# EAGLE design DMAC Replacement (EAGLE 9.6.2)

## Sheet 1 of 2
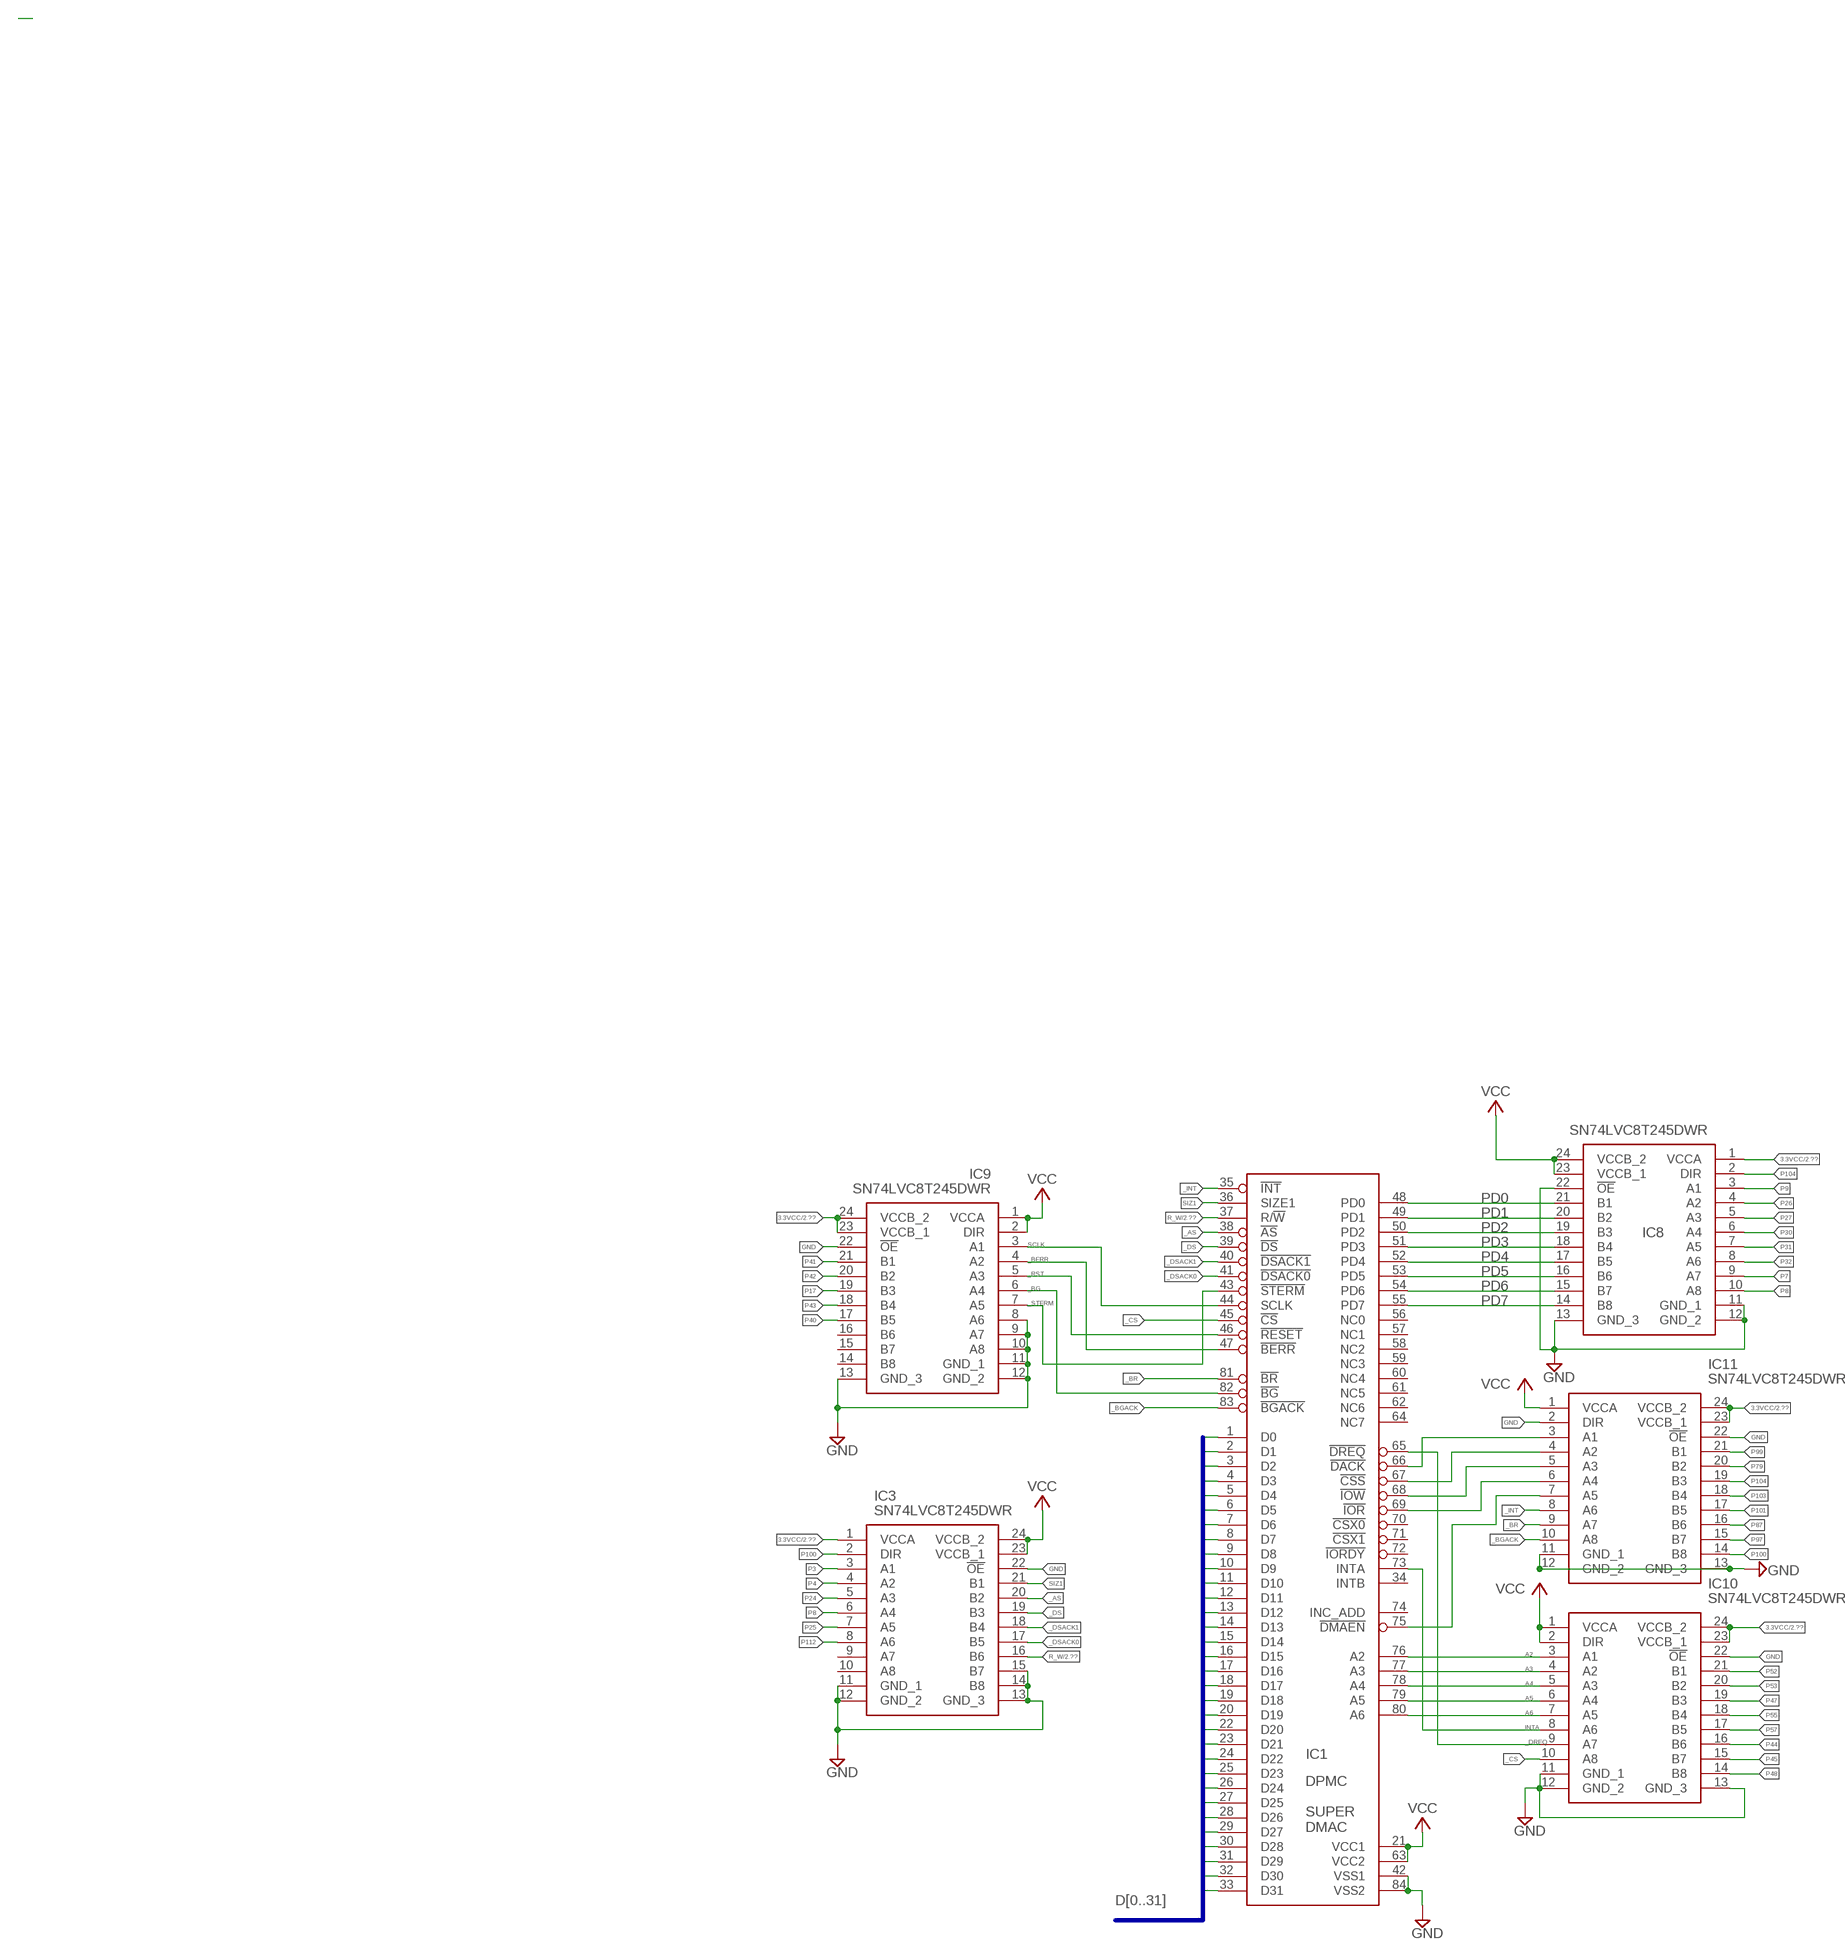
[diagram p0: schematic, sheet 1, part 1 of 2]
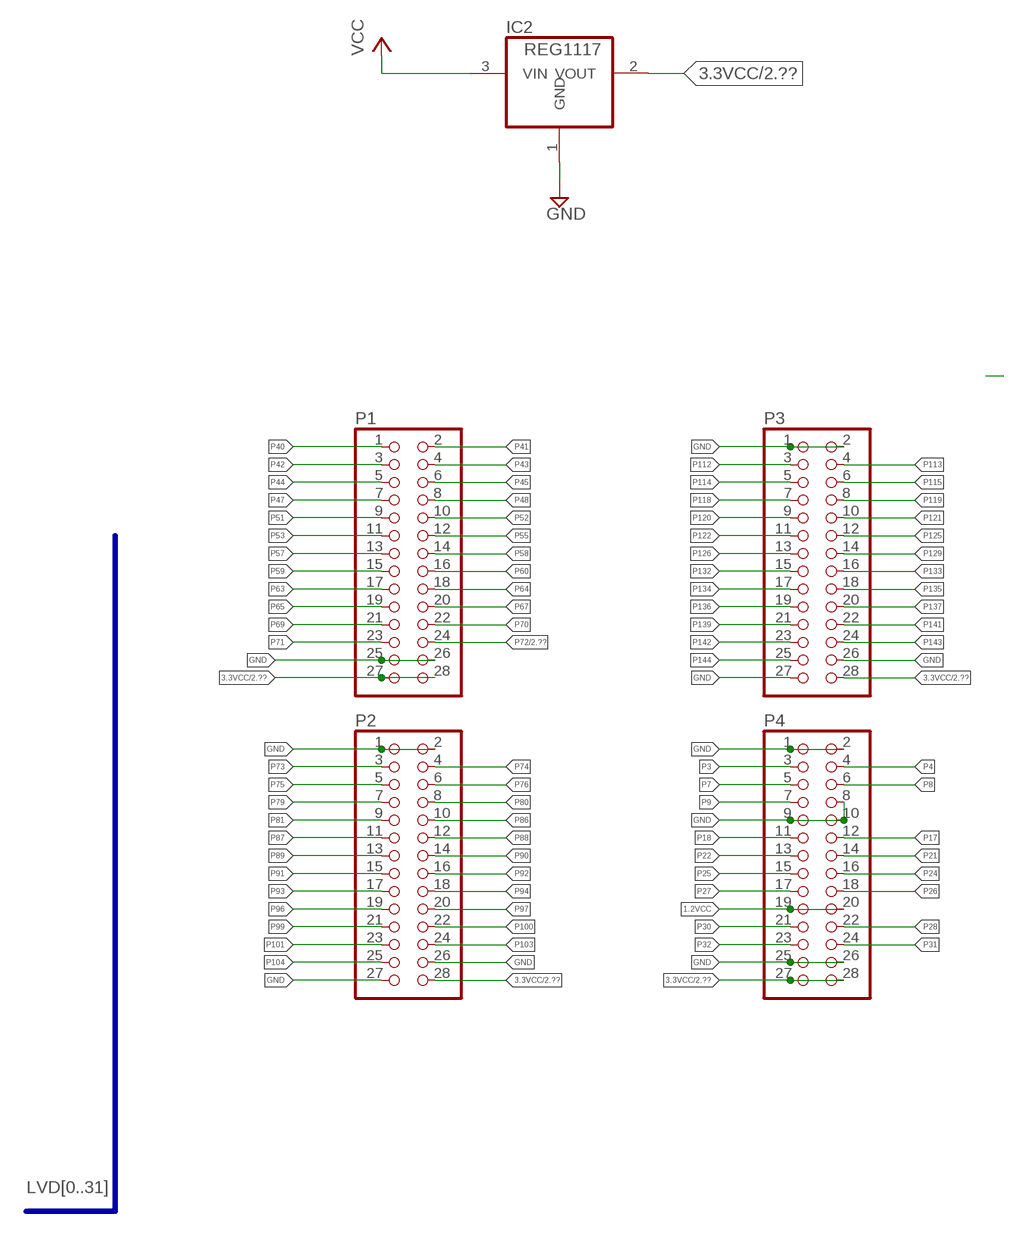
[diagram p1: schematic, sheet 1, part 2 of 2]

### Parts
IC1  SUPER_DMAC_THT  [PLCC84_T]
IC2  REG1117  [SOT223]
IC3  SN74LVC8T245DWR  [SOIC127P1030X265-24N]
IC8  SN74LVC8T245DWR  [SOIC127P1030X265-24N]
IC9  SN74LVC8T245DWR  [SOIC127P1030X265-24N]
IC10  SN74LVC8T245DWR  [SOIC127P1030X265-24N]
IC11  SN74LVC8T245DWR  [SOIC127P1030X265-24N]
P1  PINHD-2X14  [2X14]
P2  PINHD-2X14  [2X14]
P3  PINHD-2X14  [2X14]
P4  PINHD-2X14  [2X14]

### Nets
1.2VCC [Power]: P4.19 P4.20
3.3VCC [Power]: IC2.2(VOUT) IC3.1(VCCA) IC8.1(VCCA) IC9.23(VCCB_1) IC9.24(VCCB_2) IC10.23(VCCB_1) IC10.24(VCCB_2) IC11.23(VCCB_1) IC11.24(VCCB_2) P1.27 P1.28 P2.28 P3.28 P4.27 P4.28 ; also sheet 2
_AS: IC1.38(!AS) IC3.20(B2)
_BERR: IC1.47(!BERR) IC9.4(A2)
_BG: IC1.82(!BG) IC9.6(A4)
_BGACK: IC1.83(!BGACK) IC11.10(A8)
_BR: IC1.81(!BR) IC11.9(A7)
_CS: IC1.45(!CS) IC10.10(A8)
_CSS: IC1.67(!CSS) IC11.4(A2)
_DACK: IC1.66(!DACK) IC11.3(A1)
_DMAEN: IC1.75(!DMAEN) IC11.7(A5)
_DREQ: IC1.65(!DREQ) IC10.9(A7)
_DS: IC1.39(!DS) IC3.19(B3)
_DSACK0: IC1.41(!DSACK0) IC3.17(B5)
_DSACK1: IC1.40(!DSACK1) IC3.18(B4)
_INT: IC1.35(!INT) IC11.8(A6)
_IOR: IC1.69(!IOR) IC11.6(A4)
_IOW: IC1.68(!IOW) IC11.5(A3)
_RST: IC1.46(!RESET) IC9.5(A3)
_STERM: IC1.43(!STERM) IC9.7(A5)
A2: IC1.76(A2) IC10.3(A1)
A3: IC1.77(A3) IC10.4(A2)
A4: IC1.78(A4) IC10.5(A3)
A5: IC1.79(A5) IC10.6(A4)
A6: IC1.80(A6) IC10.7(A5)
D0: IC1.1(D0) ; also sheet 2
D1: IC1.2(D1) ; also sheet 2
D2: IC1.3(D2) ; also sheet 2
D3: IC1.4(D3) ; also sheet 2
D4: IC1.5(D4) ; also sheet 2
D5: IC1.6(D5) ; also sheet 2
D6: IC1.7(D6) ; also sheet 2
D7: IC1.8(D7) ; also sheet 2
D8: IC1.9(D8) ; also sheet 2
D9: IC1.10(D9) ; also sheet 2
D10: IC1.11(D10) ; also sheet 2
D11: IC1.12(D11) ; also sheet 2
D12: IC1.13(D12) ; also sheet 2
D13: IC1.14(D13) ; also sheet 2
D14: IC1.15(D14) ; also sheet 2
D15: IC1.16(D15) ; also sheet 2
D16: IC1.17(D16) ; also sheet 2
D17: IC1.18(D17) ; also sheet 2
D18: IC1.19(D18) ; also sheet 2
D19: IC1.20(D19) ; also sheet 2
D20: IC1.22(D20) ; also sheet 2
D21: IC1.23(D21) ; also sheet 2
D22: IC1.24(D22) ; also sheet 2
D23: IC1.25(D23) ; also sheet 2
D24: IC1.26(D24) ; also sheet 2
D25: IC1.27(D25) ; also sheet 2
D26: IC1.28(D26) ; also sheet 2
D27: IC1.29(D27) ; also sheet 2
D28: IC1.30(D28) ; also sheet 2
D29: IC1.31(D29) ; also sheet 2
D30: IC1.32(D30) ; also sheet 2
D31: IC1.33(D31) ; also sheet 2
GND [GND]: IC1.42(VSS1) IC1.84(VSS2) IC2.1(GND) IC3.11(GND_1) IC3.12(GND_2) IC3.13(GND_3) IC3.14(B8) IC3.15(B7) IC3.22(!OE) IC8.11(GND_1) IC8.12(GND_2) IC8.13(GND_3) IC8.22(!OE) IC9.8(A6) IC9.9(A7) IC9.10(A8) IC9.11(GND_1) IC9.12(GND_2) IC9.13(GND_3) IC9.22(!OE) IC10.11(GND_1) IC10.12(GND_2) IC10.13(GND_3) IC10.22(!OE) IC11.2(DIR) IC11.11(GND_1) IC11.12(GND_2) IC11.13(GND_3) IC11.22(!OE) P1.25 P1.26 P2.1 P2.2 P2.26 P2.27 P3.1 P3.2 P3.26 P3.27 P4.1 P4.2 P4.8 P4.9 P4.10 P4.25 P4.26 ; also sheet 2
INTA: IC1.73(INTA) IC10.8(A6)
P3: IC3.3(A1) P4.3
P4: IC3.4(A2) P4.4
P7: IC8.9(A7) P4.5
P8: IC3.6(A4) IC8.10(A8) P4.6
P9: IC8.3(A1) P4.7
P17: IC9.19(B3) P4.12
P18: P4.11
P21: P4.14
P22: P4.13
P24: IC3.5(A3) P4.16
P25: IC3.7(A5) P4.15
P26: IC8.4(A2) P4.18
P27: IC8.5(A3) P4.17
P28: P4.22
P30: IC8.6(A4) P4.21
P31: IC8.7(A5) P4.24
P32: IC8.8(A6) P4.23
P40: IC9.17(B5) P1.1
P41: IC9.21(B1) P1.2
P42: IC9.20(B2) P1.3
P43: IC9.18(B4) P1.4
P44: IC10.16(B6) P1.5
P45: IC10.15(B7) P1.6
P47: IC10.19(B3) P1.7
P48: IC10.14(B8) P1.8
P51: P1.9
P52: IC10.21(B1) P1.10
P53: IC10.20(B2) P1.11
P55: IC10.18(B4) P1.12
P57: IC10.17(B5) P1.13
P58: P1.14
P59: P1.15
P60: P1.16
P63: P1.17
P64: P1.18
P65: P1.19
P67: P1.20
P69: P1.21
P70: P1.22
P71: P1.23
P72: P1.24 ; also sheet 2
P73: P2.3
P74: P2.4
P75: P2.5
P76: P2.6
P79: IC11.20(B2) P2.7
P80: P2.8
P81: P2.9
P86: P2.10
P87: IC11.16(B6) P2.11
P88: P2.12
P89: P2.13
P90: P2.14
P91: P2.15
P92: P2.16
P93: P2.17
P94: P2.18
P96: P2.19
P97: IC11.15(B7) P2.20
P99: IC11.21(B1) P2.21
P100: IC3.2(DIR) IC11.14(B8) P2.22
P101: IC11.17(B5) P2.23
P103: IC11.18(B4) P2.24
P104: IC8.2(DIR) IC11.19(B3) P2.25
P112: IC3.8(A6) P3.3
P113: P3.4
P114: P3.5
P115: P3.6
P118: P3.7
P119: P3.8
P120: P3.9
P121: P3.10
P122: P3.11
P125: P3.12
P126: P3.13
P129: P3.14
P132: P3.15
P133: P3.16
P134: P3.17
P135: P3.18
P136: P3.19
P137: P3.20
P139: P3.21
P141: P3.22
P142: P3.23
P143: P3.24
P144: P3.25
PD0: IC1.48(PD0) IC8.21(B1)
PD1: IC1.49(PD1) IC8.20(B2)
PD2: IC1.50(PD2) IC8.19(B3)
PD3: IC1.51(PD3) IC8.18(B4)
PD4: IC1.52(PD4) IC8.17(B5)
PD5: IC1.53(PD5) IC8.16(B6)
PD6: IC1.54(PD6) IC8.15(B7)
PD7: IC1.55(PD7) IC8.14(B8)
R_W: IC1.37(R/!W!) IC3.16(B6) ; also sheet 2
SCLK: IC1.44(SCLK) IC9.3(A1)
SIZ1: IC1.36(SIZE1) IC3.21(B1)
VCC [Power]: IC1.21(VCC1) IC1.63(VCC2) IC2.3(VIN) IC3.23(VCCB_1) IC3.24(VCCB_2) IC8.23(VCCB_1) IC8.24(VCCB_2) IC9.1(VCCA) IC9.2(DIR) IC10.1(VCCA) IC10.2(DIR) IC11.1(VCCA) ; also sheet 2
Unconnected: IC1.34(INTB) IC1.56(NC0) IC1.57(NC1) IC1.58(NC2) IC1.59(NC3) IC1.60(NC4) IC1.61(NC5) IC1.62(NC6) IC1.64(NC7) IC1.70(!CSX0) IC1.71(!CSX1) IC1.72(!IORDY) IC1.74(INC_ADD) IC3.9(A7) IC3.10(A8) IC9.14(B8) IC9.15(B7) IC9.16(B6)

### Buses
D[0..31]
LVD[0..31]

## Sheet 2 of 2: Databus buffers
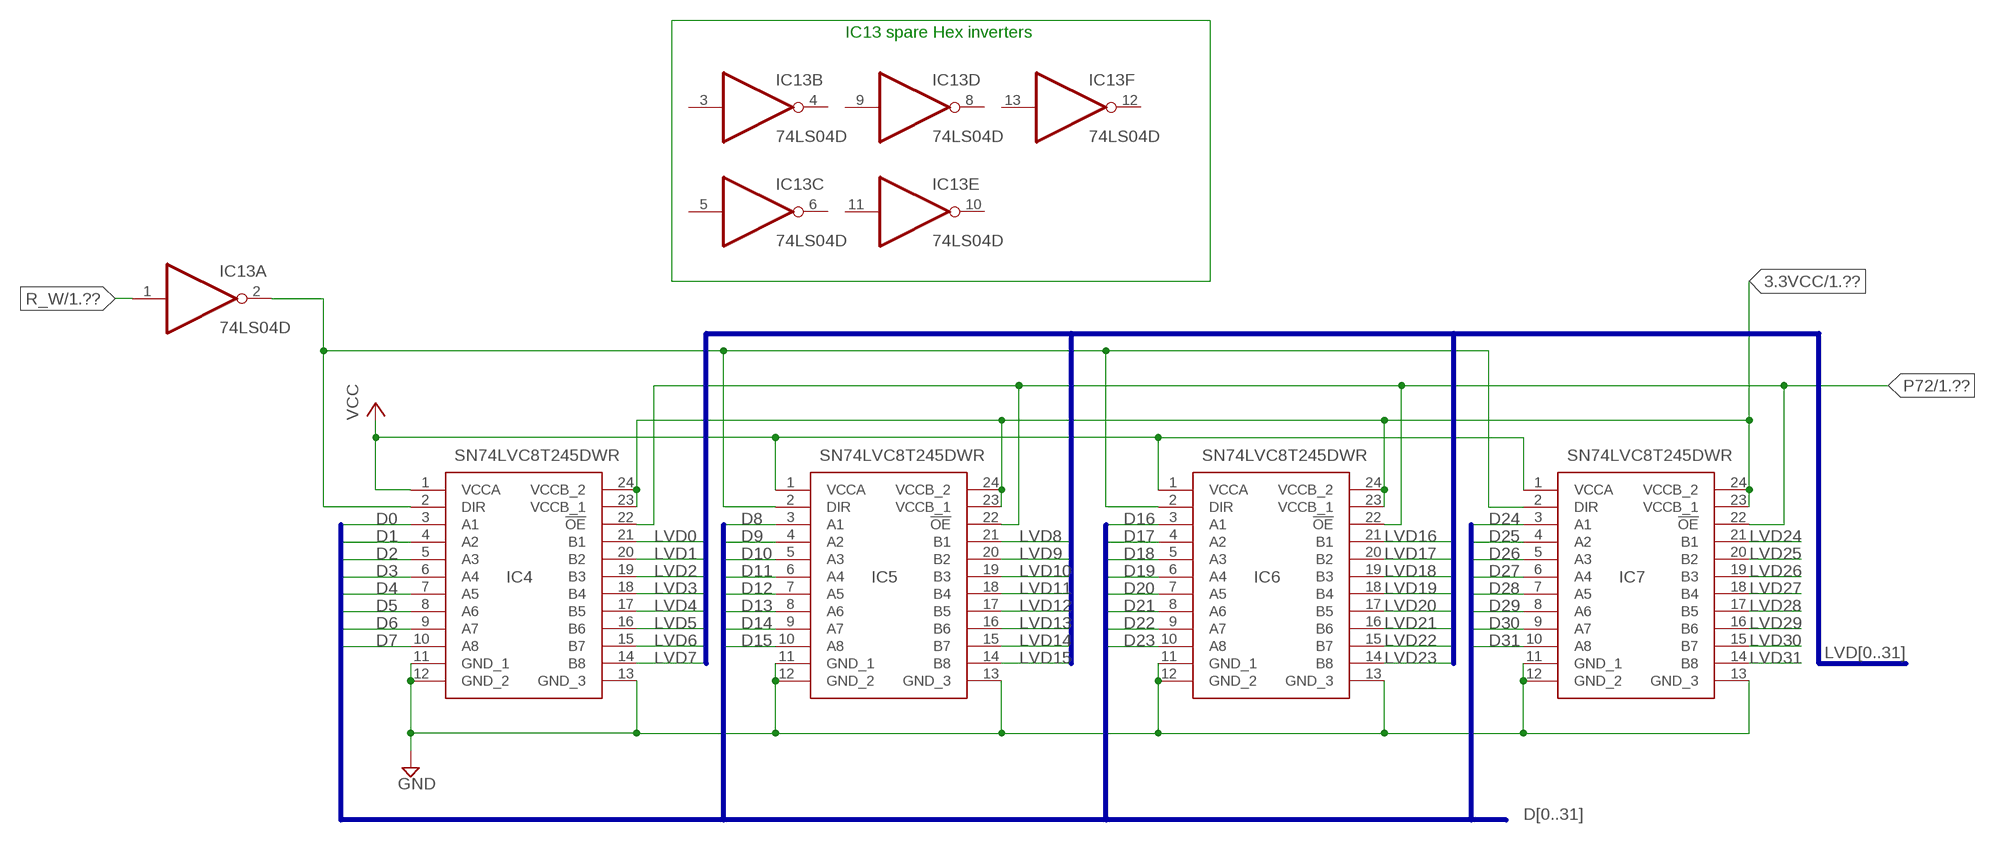
[diagram p2: schematic, sheet 2]

### Parts
IC4  SN74LVC8T245DWR  [SOIC127P1030X265-24N]
IC5  SN74LVC8T245DWR  [SOIC127P1030X265-24N]
IC6  SN74LVC8T245DWR  [SOIC127P1030X265-24N]
IC7  SN74LVC8T245DWR  [SOIC127P1030X265-24N]
IC13  74LS04D  [SO14]

### Nets
3.3VCC [Power]: IC4.23(VCCB_1) IC4.24(VCCB_2) IC5.23(VCCB_1) IC5.24(VCCB_2) IC6.23(VCCB_1) IC6.24(VCCB_2) IC7.23(VCCB_1) IC7.24(VCCB_2) ; also sheet 1
_RW: IC4.2(DIR) IC5.2(DIR) IC6.2(DIR) IC7.2(DIR) IC13.2(A:O)
D0: IC4.3(A1) ; also sheet 1
D1: IC4.4(A2) ; also sheet 1
D2: IC4.5(A3) ; also sheet 1
D3: IC4.6(A4) ; also sheet 1
D4: IC4.7(A5) ; also sheet 1
D5: IC4.8(A6) ; also sheet 1
D6: IC4.9(A7) ; also sheet 1
D7: IC4.10(A8) ; also sheet 1
D8: IC5.3(A1) ; also sheet 1
D9: IC5.4(A2) ; also sheet 1
D10: IC5.5(A3) ; also sheet 1
D11: IC5.6(A4) ; also sheet 1
D12: IC5.7(A5) ; also sheet 1
D13: IC5.8(A6) ; also sheet 1
D14: IC5.9(A7) ; also sheet 1
D15: IC5.10(A8) ; also sheet 1
D16: IC6.3(A1) ; also sheet 1
D17: IC6.4(A2) ; also sheet 1
D18: IC6.5(A3) ; also sheet 1
D19: IC6.6(A4) ; also sheet 1
D20: IC6.7(A5) ; also sheet 1
D21: IC6.8(A6) ; also sheet 1
D22: IC6.9(A7) ; also sheet 1
D23: IC6.10(A8) ; also sheet 1
D24: IC7.3(A1) ; also sheet 1
D25: IC7.4(A2) ; also sheet 1
D26: IC7.5(A3) ; also sheet 1
D27: IC7.6(A4) ; also sheet 1
D28: IC7.7(A5) ; also sheet 1
D29: IC7.8(A6) ; also sheet 1
D30: IC7.9(A7) ; also sheet 1
D31: IC7.10(A8) ; also sheet 1
GND [GND]: IC4.11(GND_1) IC4.12(GND_2) IC4.13(GND_3) IC5.11(GND_1) IC5.12(GND_2) IC5.13(GND_3) IC6.11(GND_1) IC6.12(GND_2) IC6.13(GND_3) IC7.11(GND_1) IC7.12(GND_2) IC7.13(GND_3) ; also sheet 1
LVD0: IC4.21(B1)
LVD1: IC4.20(B2)
LVD2: IC4.19(B3)
LVD3: IC4.18(B4)
LVD4: IC4.17(B5)
LVD5: IC4.16(B6)
LVD6: IC4.15(B7)
LVD7: IC4.14(B8)
LVD8: IC5.21(B1)
LVD9: IC5.20(B2)
LVD10: IC5.19(B3)
LVD11: IC5.18(B4)
LVD12: IC5.17(B5)
LVD13: IC5.16(B6)
LVD14: IC5.15(B7)
LVD15: IC5.14(B8)
LVD16: IC6.21(B1)
LVD17: IC6.20(B2)
LVD18: IC6.19(B3)
LVD19: IC6.18(B4)
LVD20: IC6.17(B5)
LVD21: IC6.16(B6)
LVD22: IC6.15(B7)
LVD23: IC6.14(B8)
LVD24: IC7.21(B1)
LVD25: IC7.20(B2)
LVD26: IC7.19(B3)
LVD27: IC7.18(B4)
LVD28: IC7.17(B5)
LVD29: IC7.16(B6)
LVD30: IC7.15(B7)
LVD31: IC7.14(B8)
P72: IC4.22(!OE) IC5.22(!OE) IC6.22(!OE) IC7.22(!OE) ; also sheet 1
R_W: IC13.1(A:I) ; also sheet 1
VCC [Power]: IC4.1(VCCA) IC5.1(VCCA) IC6.1(VCCA) IC7.1(VCCA) ; also sheet 1
Unconnected: IC13.3(B:I) IC13.4(B:O) IC13.5(C:I) IC13.6(C:O) IC13.8(D:O) IC13.9(D:I) IC13.10(E:O) IC13.11(E:I) IC13.12(F:O) IC13.13(F:I)

### Buses
D[0..31]
LVD[0..31]

### Notes on the sheet
- IC13 spare Hex inverters

## Power pins joined to a net without a drawn wire
GND: IC13.7(P:GND)
VCC: IC13.14(P:VCC)

## Library data of the parts
IC1 = Amiga:SUPER_DMAC
IC2 = burr-brown:REG1117: 800mA and 1A Low Dropout (LDO) Positive Regulator 1.8V, 2.5V, 2.85V, 3.3V, 5V, and Adj; MPN: REG1117; OC_FARNELL: 1097566; OC_NEWARK: 14P6981
IC3-IC11 = SamacSys_Parts:SN74LVC8T245DWR: 8-Bit Dual-Supply Bus Transceiver with Configurable Voltage-Level Shifting and Three-State Outputs Source: Datasheet <http://www.ti.com/lit/gpn/sn74lvc8t245>; DESCRIPTION: 8-Bit Dual-Supply Bus Transceiver with Configurable Voltage-Level Shifting and Three-State Outputs; HEIGHT: 2.65mm; MANUFACTURER_NAME: Texas Instruments; MANUFACTURER_PART_NUMBER: SN74LVC8T245DWR; MOUSER_PART_NUMBER: 595-SN74LVC8T245DWR; MOUSER_PRICE-STOCK: https://www.mouser.co.uk/ProductDetail/Texas-Instruments/SN74LVC8T245DWR/?qs=dT9u2OTAaVX2fwsENIjeqA%3D%3D
IC13 = 74xx-eu:74*04: Hex INVERTER
P1-P4 = pinhead:PINHD-2X14: PIN HEADER

## Net classes
0 default: width 0.152 mm
1 GND: width 0.305 mm
2 Power: width 0.305 mm

## Board
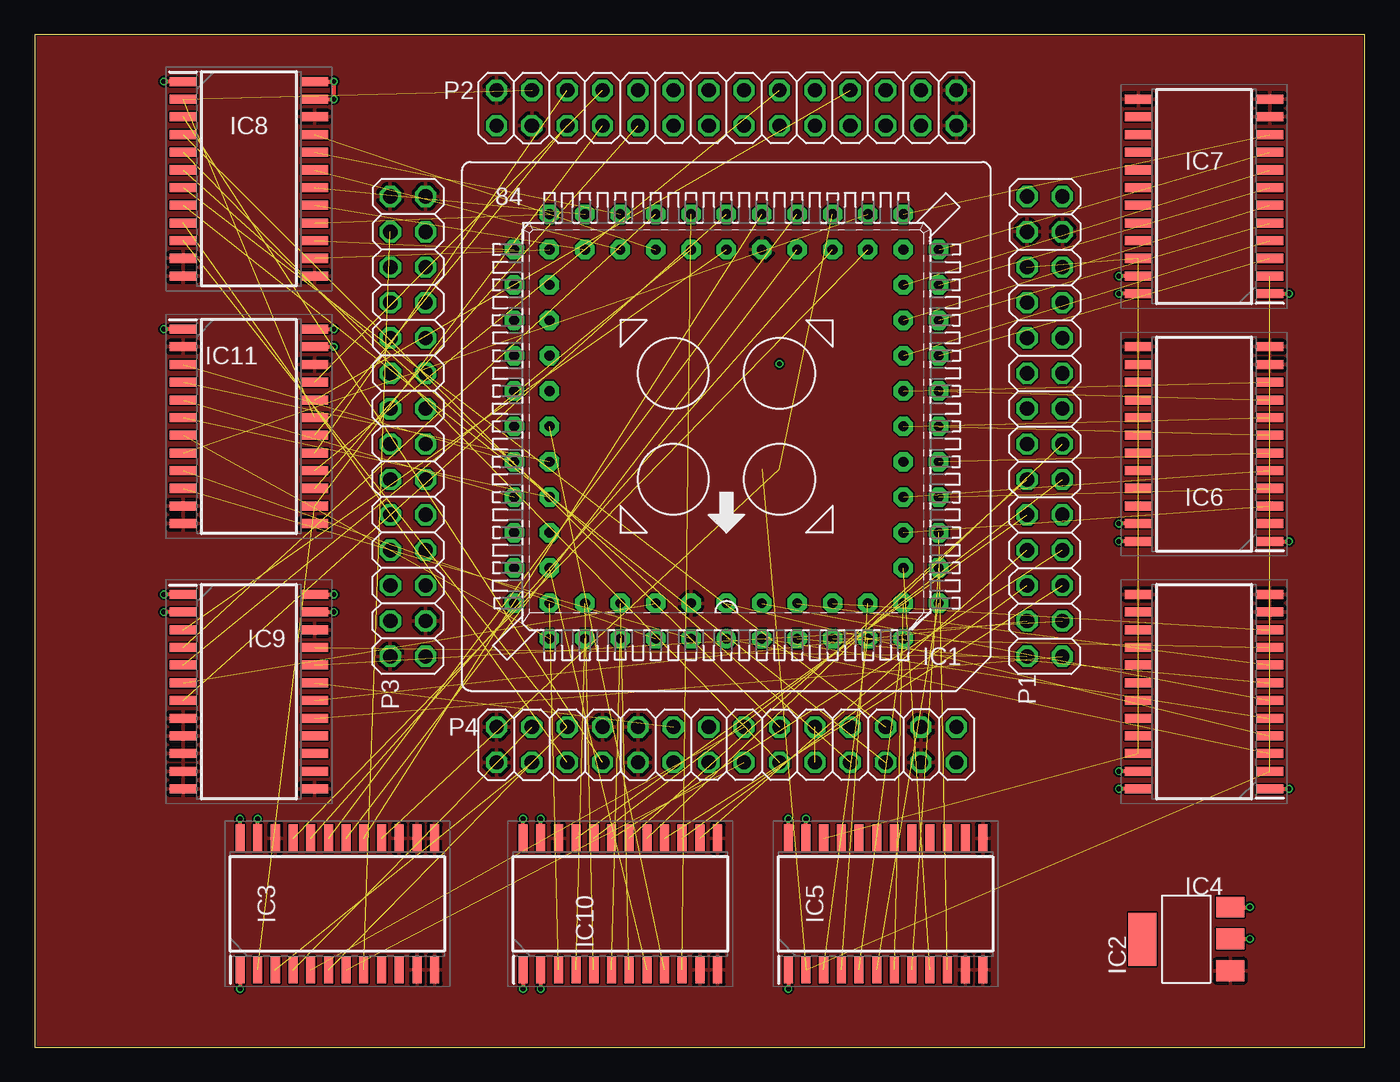
[diagram p3: board, top side]
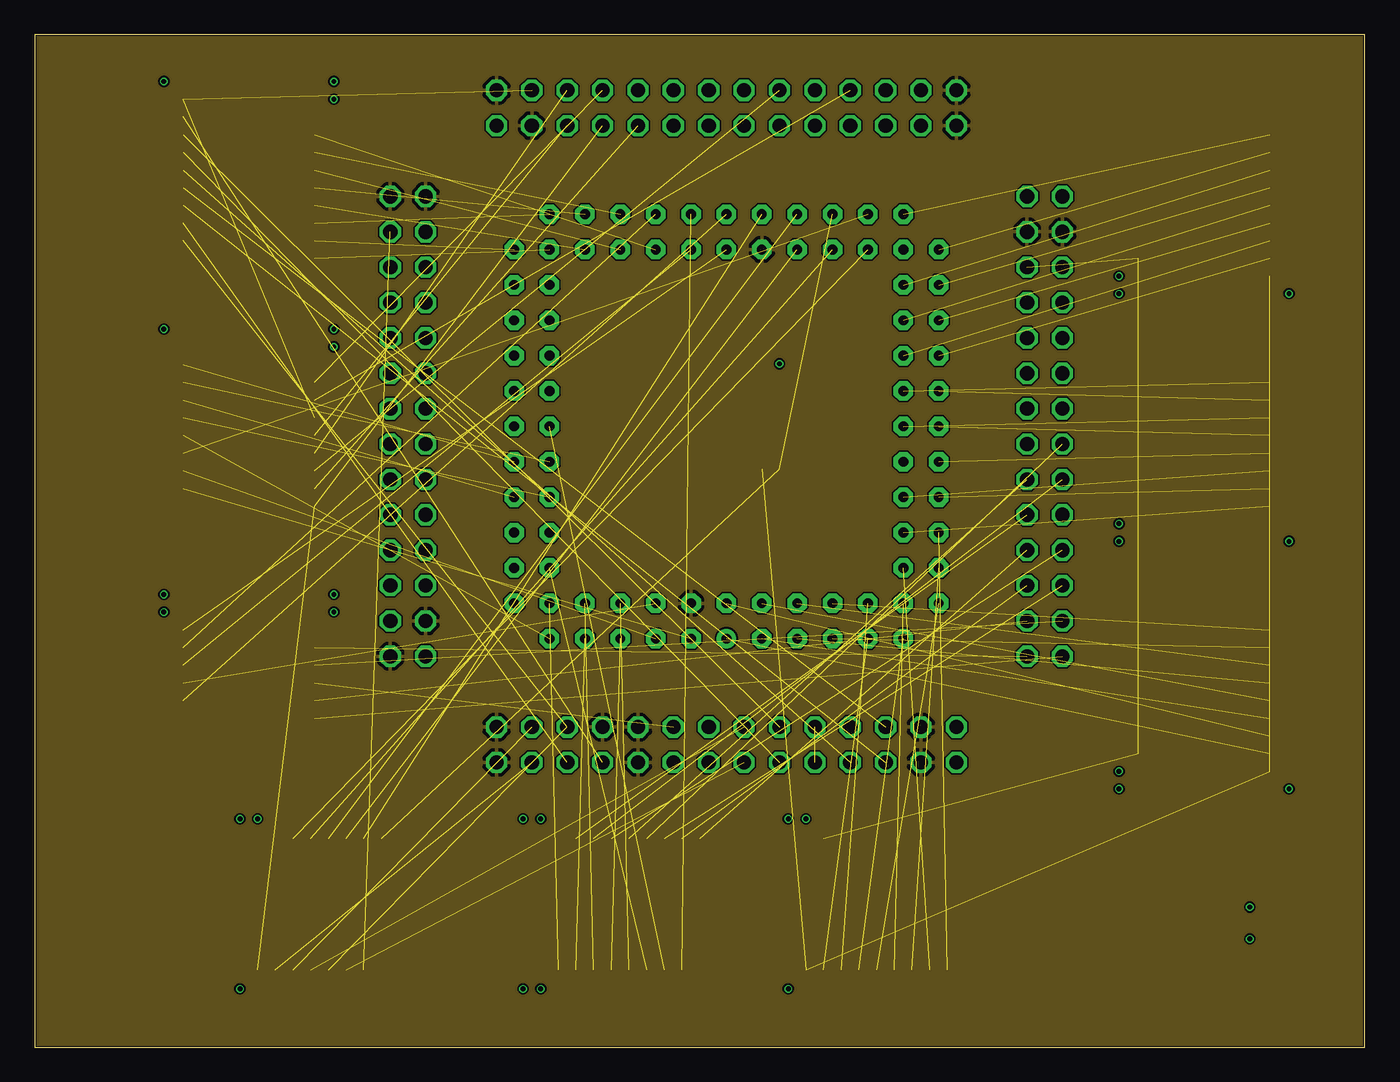
[diagram p4: board, inner layer GND]
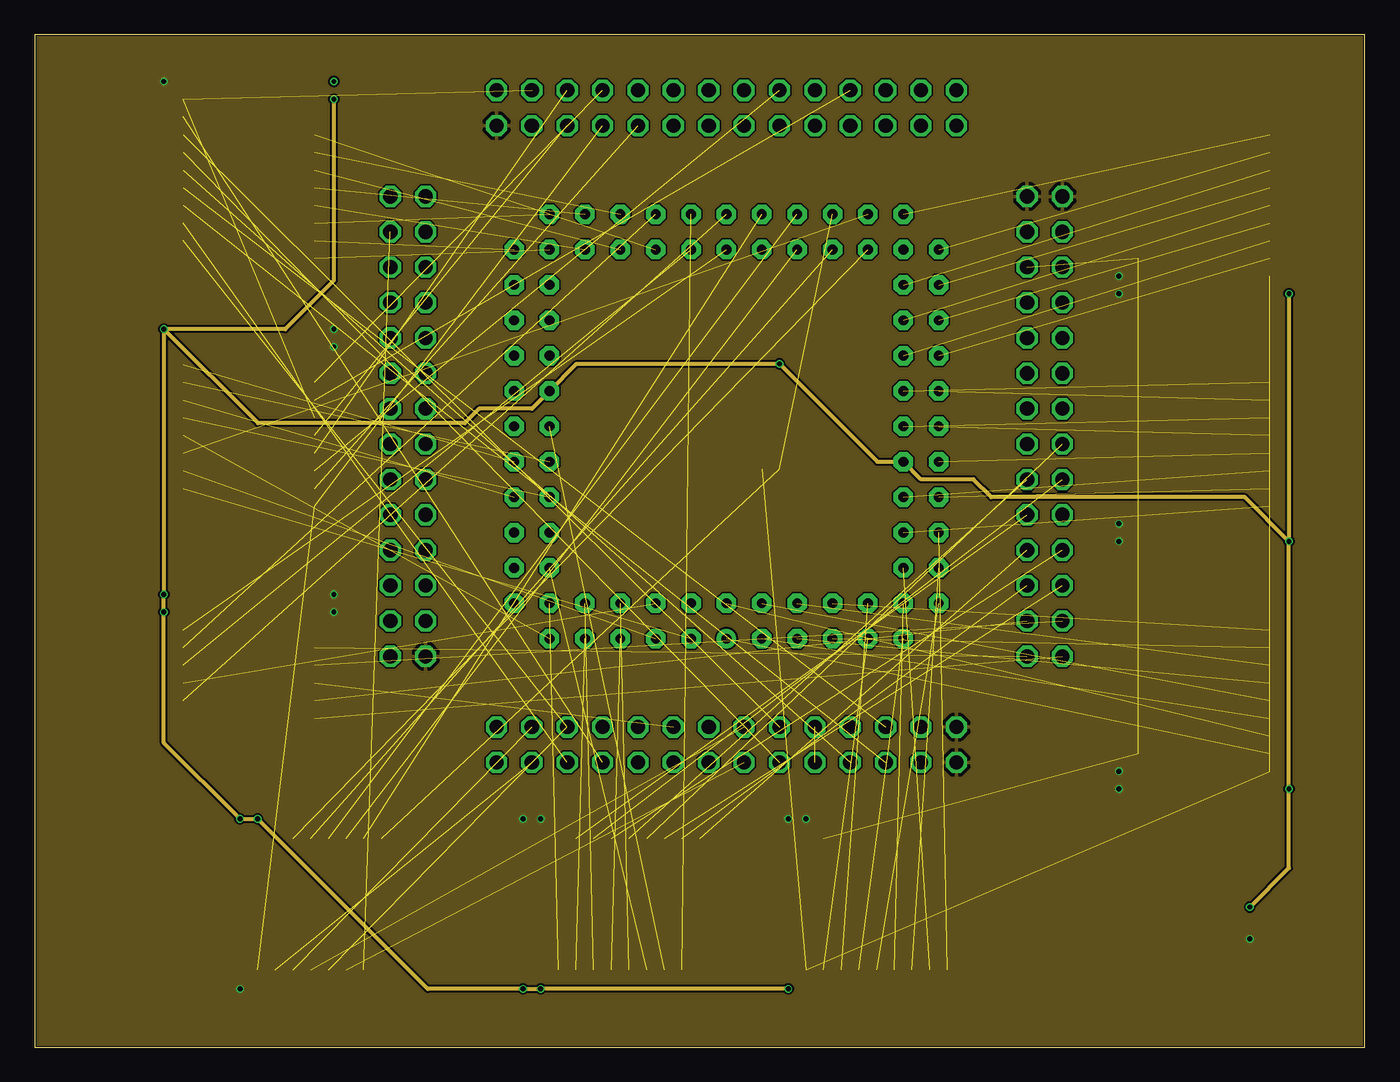
[diagram p5: board, inner layer Power]
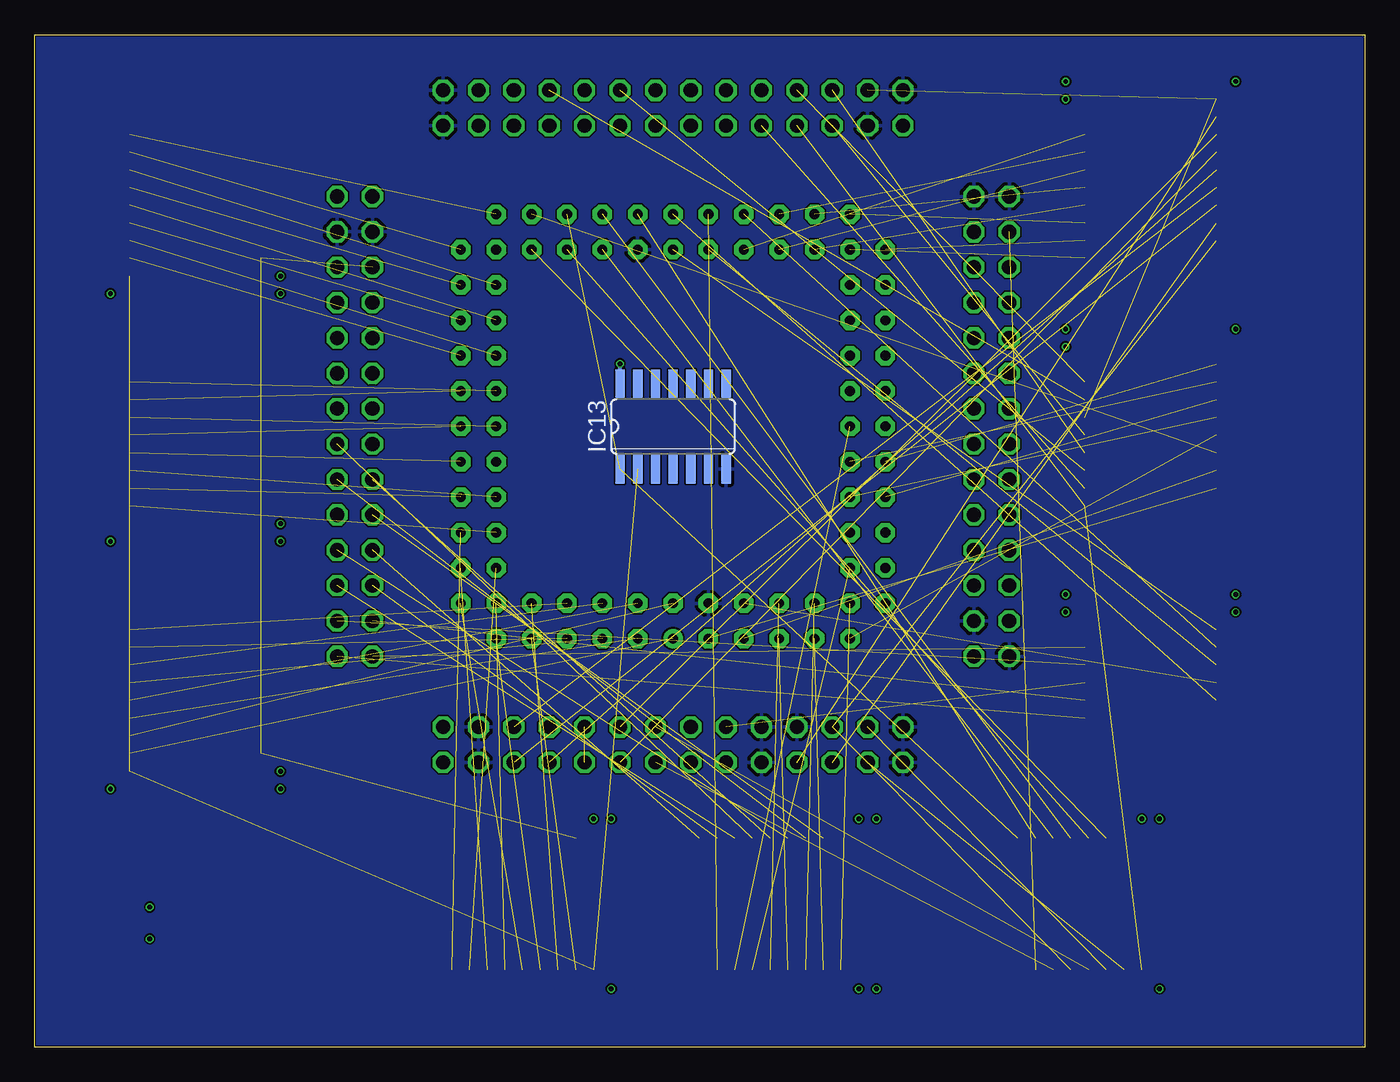
[diagram p6: board, bottom side, seen from below]

Size 95.48 x 72.7 mm. Coordinates in mm from the lower left corner, seen from the top.
Outline: 0,0 95.48,0 95.48,72.7 0,72.7 0,0
Copper layers (1*2*15*16): Top 0.035559375mm / dielectric 0.17018125mm / GND 0.01778125mm / dielectric 47mil / Power 0.01778125mm / dielectric 0.17018125mm / Bottom 0.035559375mm
Design rules "jlcpcb-4-layer": minimum track width 5mil, minimum drill 0.2mm, track to track 0.126490625mm, track to pad 0.126490625mm, pad to pad 0.126490625mm, via to via 0.126490625mm, smd to smd 0mil, copper to edge 0.1mm, drill to drill 5mil, minimum pad ring 4mil, minimum via ring 4mil, stop-mask expansion 3mil, vias tented up to drill 100mil, thermal gap 10mil

### Footprints (pad centres in the part's own frame; a part is rotated, then mirrored left to right if it is on the bottom)
PLCC84_T = drill 0.7 pad 1.4: 1 0,15.24 | drill 0.7 pad 1.4 octagon: 2 0,12.7; 3 -2.54,15.24; 4 -2.54,12.7; 5 -5.08,15.24; 6 -5.08,12.7; 7 -7.62,15.24; 8 -7.62,12.7; 9 -10.16,15.24; 10 -10.16,12.7; 11 -12.7,15.24; 12 -15.24,12.7; 13 -12.7,12.7; 14 -15.24,10.16; 15 -12.7,10.16; 16 -15.24,7.62; 17 -12.7,7.62; 18 -15.24,5.08; 19 -12.7,5.08; 20 -15.24,2.54; 21 -12.7,2.54; 22 -15.24,0; 23 -12.7,0; 24 -15.24,-2.54; 25 -12.7,-2.54; 26 -15.24,-5.08; 27 -12.7,-5.08; 28 -15.24,-7.62; 29 -12.7,-7.62; 30 -15.24,-10.16; 31 -12.7,-10.16; 32 -15.24,-12.7; 33 -12.7,-15.24; 34 -12.7,-12.7; 35 -10.16,-15.24; 36 -10.16,-12.7; 37 -7.62,-15.24; 38 -7.62,-12.7; 39 -5.08,-15.24; 40 -5.08,-12.7; 41 -2.54,-15.24; 42 -2.54,-12.7; 43 0,-15.24; 44 0,-12.7; 45 2.54,-15.24; 46 2.54,-12.7; 47 5.08,-15.24; 48 5.08,-12.7; 49 7.62,-15.24; 50 7.62,-12.7; 51 10.16,-15.24; 52 10.16,-12.7; 53 12.7,-15.24; 54 15.24,-12.7; 55 12.7,-12.7; 56 15.24,-10.16; 57 12.7,-10.16; 58 15.24,-7.62; 59 12.7,-7.62; 60 15.24,-5.08; 61 12.7,-5.08; 62 15.24,-2.54; 63 12.7,-2.54; 64 15.24,0; 65 12.7,0; 66 15.24,2.54; 67 12.7,2.54; 68 15.24,5.08; 69 12.7,5.08; 70 15.24,7.62; 71 12.7,7.62; 72 15.24,10.16; 73 12.7,10.16; 74 15.24,12.7; 75 12.7,15.24; 76 12.7,12.7; 77 10.16,15.24; 78 10.16,12.7; 79 7.62,15.24; 80 7.62,12.7; 81 5.08,15.24; 82 5.08,12.7; 83 2.54,15.24; 84 2.54,12.7
SOT223 = smd 1.499 x 2.007: 1 -2.261,-3.15; 2 0.025,-3.15; 3 2.311,-3.15 | smd 3.81 x 2.007: 4 0,3.15
SOIC127P1030X265-24N = smd 1.95 x 0.65: 1 -4.725,6.985; 2 -4.725,5.715; 3 -4.725,4.445; 4 -4.725,3.175; 5 -4.725,1.905; 6 -4.725,0.635; 7 -4.725,-0.635; 8 -4.725,-1.905; 9 -4.725,-3.175; 10 -4.725,-4.445; 11 -4.725,-5.715; 12 -4.725,-6.985; 13 4.725,-6.985; 14 4.725,-5.715; 15 4.725,-4.445; 16 4.725,-3.175; 17 4.725,-1.905; 18 4.725,-0.635; 19 4.725,0.635; 20 4.725,1.905; 21 4.725,3.175; 22 4.725,4.445; 23 4.725,5.715; 24 4.725,6.985
SO14 = smd 0.66 x 2.032: 1 -3.81,-3.073; 2 -2.54,-3.073; 3 -1.27,-3.073; 4 0,-3.073; 5 1.27,-3.073; 6 2.54,-3.073; 7 3.81,-3.073; 8 3.81,3.073; 9 2.54,3.073; 10 1.27,3.073; 11 0,3.073; 12 -1.27,3.073; 13 -2.54,3.073; 14 -3.81,3.073
2X14 = drill 1.016 octagon: 1 -16.51,-1.27; 2 -16.51,1.27; 3 -13.97,-1.27; 4 -13.97,1.27; 5 -11.43,-1.27; 6 -11.43,1.27; 7 -8.89,-1.27; 8 -8.89,1.27; 9 -6.35,-1.27; 10 -6.35,1.27; 11 -3.81,-1.27; 12 -3.81,1.27; 13 -1.27,-1.27; 14 -1.27,1.27; 15 1.27,-1.27; 16 1.27,1.27; 17 3.81,-1.27; 18 3.81,1.27; 19 6.35,-1.27; 20 6.35,1.27; 21 8.89,-1.27; 22 8.89,1.27; 23 11.43,-1.27; 24 11.43,1.27; 25 13.97,-1.27; 26 13.97,1.27; 27 16.51,-1.27; 28 16.51,1.27

### Placement (x,y rotation side)
IC1  49.66,44.58 180 top
IC2  82.68,7.75 90 top
IC3  21.72,10.29 90 top
IC4  83.95,25.53 180 top
IC5  61.09,10.29 90 top
IC6  83.95,43.31 180 top
IC7  83.95,61.09 180 top
IC8  15.37,62.36 0 top
IC9  15.37,25.53 0 top
IC10  42.04,10.29 90 top
IC11  15.37,44.58 0 top
IC13  49.66,44.58 0 bottom
P1  72.52,44.58 90 top
P2  49.66,67.44 180 top
P3  26.8,44.58 270 top
P4  49.66,21.72 0 top

### Tracks (layer width: path | path; a pad name or v marks a point on that pad's centre or on a via)
1.2VCC  (1 unrouted)
3.3VCC  (via drill 0.35)
  Top 0.305: IC2.2 v87.23,7.77 | IC7.24 v77.84,54.1 | IC7.23 v77.84,55.37 | IC5.24 v54.1,16.39 | IC5.23 v55.37,16.39 | IC4.24 v77.84,18.54 | IC4.23 v77.84,19.81 | IC6.24 v77.84,36.32 | IC6.23 v77.84,37.59 | IC10.24 v35.05,16.39 | IC10.23 v36.32,16.39 | IC11.24 v21.47,51.56 | IC11.23 v21.47,50.29 | IC8.1 v9.26,69.34 | IC9.24 v21.47,32.51 | IC9.23 v21.47,31.24 | IC3.1 v14.73,4.18
  pour Power: 0.13,72.52 0.13,0.13 95.38,0.13 95.38,72.52
_AS  (1 unrouted)
_BERR  (1 unrouted)
_BG  (1 unrouted)
_BGACK  (1 unrouted)
_BR  (1 unrouted)
_CS  (1 unrouted)
_CSS  (1 unrouted)
_DACK  (1 unrouted)
_DMAEN  (1 unrouted)
_DREQ  (1 unrouted)
_DS  (1 unrouted)
_DSACK0  (1 unrouted)
_DSACK1  (1 unrouted)
_INT  (1 unrouted)
_IOR  (1 unrouted)
_IOW  (1 unrouted)
_RST  (1 unrouted)
_RW  (4 unrouted)
_STERM  (1 unrouted)
A2  (1 unrouted)
A3  (1 unrouted)
A4  (1 unrouted)
A5  (1 unrouted)
A6  (1 unrouted)
D0  (1 unrouted)
D1  (1 unrouted)
D2  (1 unrouted)
D3  (1 unrouted)
D4  (1 unrouted)
D5  (1 unrouted)
D6  (1 unrouted)
D7  (1 unrouted)
D8  (1 unrouted)
D9  (1 unrouted)
D10  (1 unrouted)
D11  (1 unrouted)
D12  (1 unrouted)
D13  (1 unrouted)
D14  (1 unrouted)
D15  (1 unrouted)
D16  (1 unrouted)
D17  (1 unrouted)
D18  (1 unrouted)
D19  (1 unrouted)
D20  (1 unrouted)
D21  (1 unrouted)
D22  (1 unrouted)
D23  (1 unrouted)
D24  (1 unrouted)
D25  (1 unrouted)
D26  (1 unrouted)
D27  (1 unrouted)
D28  (1 unrouted)
D29  (1 unrouted)
D30  (1 unrouted)
D31  (1 unrouted)
GND
  pour Top: 0.13,72.52 0.13,0.13 95.38,0.13 95.38,72.52
  pour Bottom: 0.13,72.52 0.13,0.13 95.38,0.13 95.38,72.52
  pour GND: 0.13,72.52 0.13,0.13 95.38,0.13 95.38,72.52
INTA  (1 unrouted)
P3  (1 unrouted)
P4  (1 unrouted)
P7  (1 unrouted)
P8  (2 unrouted)
P9  (1 unrouted)
P17  (1 unrouted)
P24  (1 unrouted)
P25  (1 unrouted)
P26  (1 unrouted)
P27  (1 unrouted)
P30  (1 unrouted)
P31  (1 unrouted)
P32  (1 unrouted)
P40  (1 unrouted)
P41  (1 unrouted)
P42  (1 unrouted)
P43  (1 unrouted)
P44  (1 unrouted)
P45  (1 unrouted)
P47  (1 unrouted)
P48  (1 unrouted)
P52  (1 unrouted)
P53  (1 unrouted)
P55  (1 unrouted)
P57  (1 unrouted)
P72  (4 unrouted)
P79  (1 unrouted)
P87  (1 unrouted)
P97  (1 unrouted)
P99  (1 unrouted)
P100  (2 unrouted)
P101  (1 unrouted)
P103  (1 unrouted)
P104  (2 unrouted)
P112  (1 unrouted)
PD0  (1 unrouted)
PD1  (1 unrouted)
PD2  (1 unrouted)
PD3  (1 unrouted)
PD4  (1 unrouted)
PD5  (1 unrouted)
PD6  (1 unrouted)
PD7  (1 unrouted)
R_W  (2 unrouted)
SCLK  (1 unrouted)
SIZ1  (1 unrouted)
VCC  (via drill 0.35)
  Top 0.305: IC5.1 v54.1,4.18 | IC2.3 v87.23,10.06 | IC7.1 v90.05,54.1 | IC4.1 v90.05,18.54 | IC6.1 v90.05,36.32 | IC10.1 v35.05,4.18 | IC10.2 v36.32,4.18 | IC11.1 v9.26,51.56 | IC8.24 v21.47,69.34 v21.47,68.07 IC8.23 | IC9.1 v9.26,32.51 | IC9.2 v9.26,31.24 | IC3.24 v14.73,16.39 | IC3.23 v16,16.39
  Power 0.305: v9.26,51.56 16.02,44.81 30.87,44.81 31.91,45.85 35.69,45.85 IC1.63 38.91,49.07 v53.47,49.07 60.5,42.04 IC1.21 63.63,40.77 67.4,40.77 68.67,39.5 86.88,39.5 v90.05,36.32 | v90.05,36.32 v90.05,18.54 90.05,12.88 v87.23,10.06 | v90.05,54.1 v90.05,36.32 | v21.47,68.07 21.47,55.06 17.98,51.56 v9.26,51.56 | v54.1,4.18 v36.32,4.18 v35.05,4.18 28.21,4.18 v16,16.39 v14.73,16.39 9.26,21.86 v9.26,31.24 v9.26,32.51 v9.26,51.56
  Bottom 0.305: IC13.14 v53.47,49.07